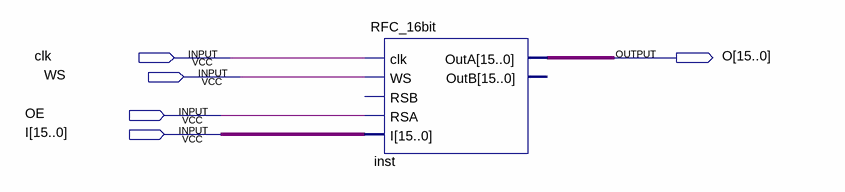
[diagram p0: schematic sheet]
// Quartus schematic REG16bit.bdf as structural Verilog: 1 symbols, 5 pins
module REG16bit (
  input  clk,
  input  WS,
  input  OE,
  input  [15:0] I,
  output [15:0] O
);

  RFC_16bit inst (.clk(clk), .WS(WS), .RSA(OE), .I(I), .OutA(O));  // open: RSB, OutB
endmodule
